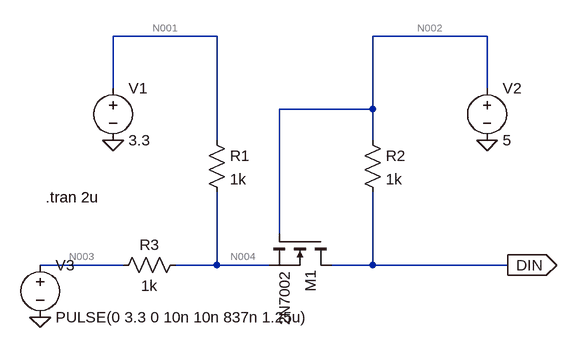
[diagram p0: schematic Level Shifter.asc]
Level Shifter.asc, the LTspice schematic file:
Version 4
SHEET 1 880 680
WIRE 160 -128 0 -128
WIRE 576 -128 400 -128
WIRE 0 -48 0 -128
WIRE 576 -48 576 -128
WIRE 400 -16 400 -128
WIRE 400 -16 256 -16
WIRE 160 32 160 -128
WIRE 400 32 400 -16
WIRE 256 176 256 -16
WIRE 16 224 -112 224
WIRE 160 224 160 112
WIRE 160 224 96 224
WIRE 240 224 160 224
WIRE 400 224 400 112
WIRE 400 224 336 224
WIRE 608 224 400 224
FLAG 576 32 0
FLAG 0 32 0
FLAG -112 304 0
FLAG 608 224 DIN
IOPIN 608 224 Out
SYMBOL res 144 16 R0
SYMATTR InstName R1
SYMATTR Value 1k
SYMBOL res 384 16 R0
SYMATTR InstName R2
SYMATTR Value 1k
SYMBOL voltage 0 -64 R0
WINDOW 123 0 0 Left 0
WINDOW 39 0 0 Left 0
SYMATTR InstName V1
SYMATTR Value 3.3
SYMBOL voltage 576 -64 R0
WINDOW 123 0 0 Left 0
WINDOW 39 0 0 Left 0
SYMATTR InstName V2
SYMATTR Value 5
SYMBOL voltage -112 208 R0
WINDOW 123 0 0 Left 0
WINDOW 39 0 0 Left 0
SYMATTR InstName V3
SYMATTR Value PULSE(0 3.3 0 10n 10n 837n 1.25u)
SYMBOL nmos 336 176 R90
SYMATTR InstName M1
SYMATTR Value 2N7002
SYMBOL res 112 208 R90
WINDOW 0 0 56 VBottom 2
WINDOW 3 32 56 VTop 2
SYMATTR InstName R3
SYMATTR Value 1k
TEXT -104 120 Left 2 !.tran 2u

The netlist it stands for:
* Level Shifter.asc
R1 N001 N004 1k
R2 N002 DIN 1k
V1 N001 0 3.3
V2 N002 0 5
V3 N003 0 PULSE(0 3.3 0 10n 10n 837n 1.25u)
M1 DIN N002 N004 N004 2N7002
R3 N004 N003 1k
.model NMOS NMOS
.model PMOS PMOS
.lib standard.mos
.tran 2u
.backanno
.end

* Results of the author's LTspice run, read from the files saved beside the schematic
* Operating Point, zero values left out:
*   V(n001) = 3.3 V
*   V(n004) = 2.761 V
*   V(n002) = 5 V
*   V(din) = 2.779 V
*   Id(M1) = 2.221 mA
*   Is(M1) = -2.221 mA
*   I(R3) = 2.761 mA
*   I(R2) = 2.221 mA
*   I(R1) = 539.4 µA
*   I(V3) = 2.761 mA
*   I(V2) = -2.221 mA
*   I(V1) = -539.4 µA
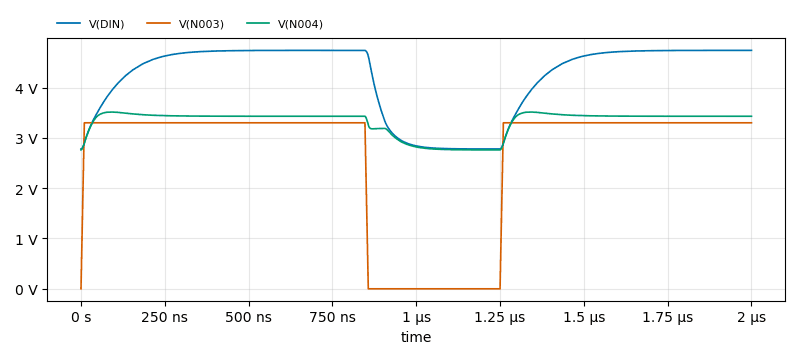
[diagram p1: Transient Analysis of Level Shifter.asc, plotted from the saved traces]
* Transient Analysis, 1 run:
*   V(DIN): min 2.779 V, max 4.74 V, average 4.207 V, rms 4.272 V, last 4.74 V
*   V(N003): min 0 V, max 3.3 V, average 2.627 V, rms 2.94 V, last 3.3 V
*   V(N004): min 2.761 V, max 3.513 V, average 3.315 V, rms 3.324 V, last 3.43 V